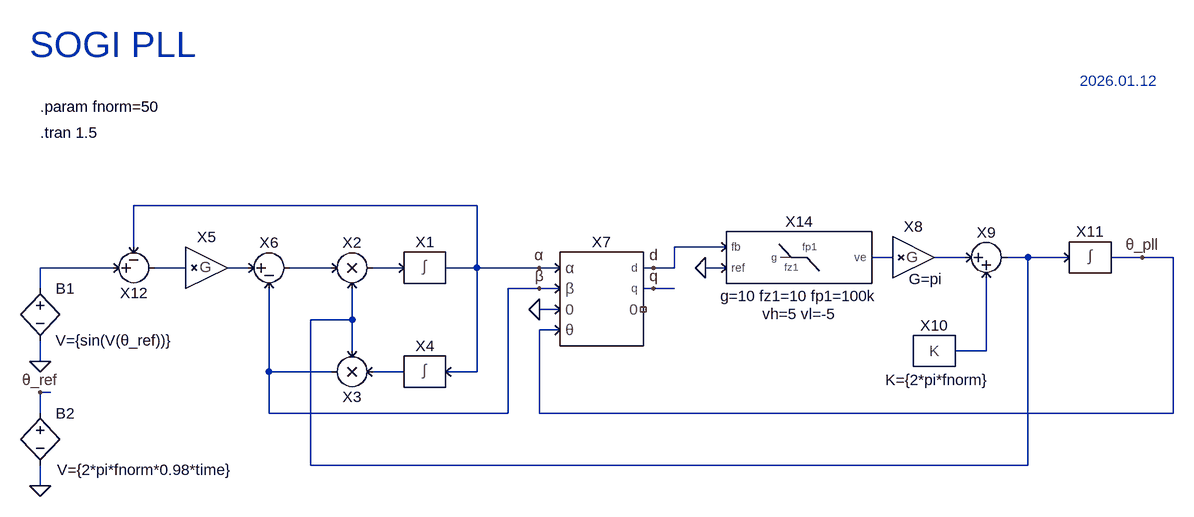
[diagram p0: schematic SOGI_PLL.asc]
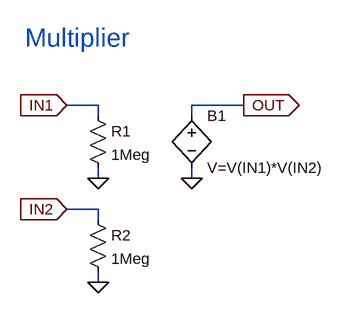
[diagram p1: sub-circuit mul.asc]
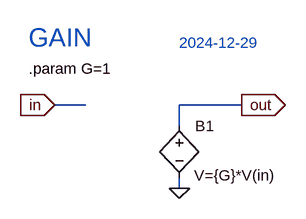
[diagram p2: sub-circuit gain.asc]
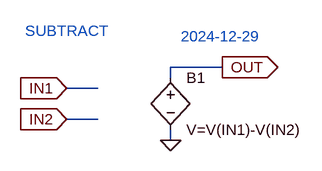
[diagram p3: sub-circuit sub.asc]
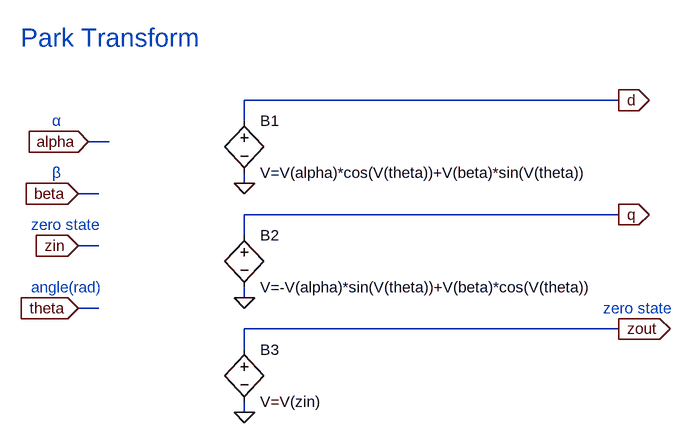
[diagram p4: sub-circuit park.asc]
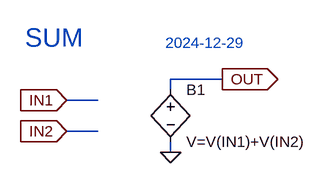
[diagram p5: sub-circuit sum.asc]
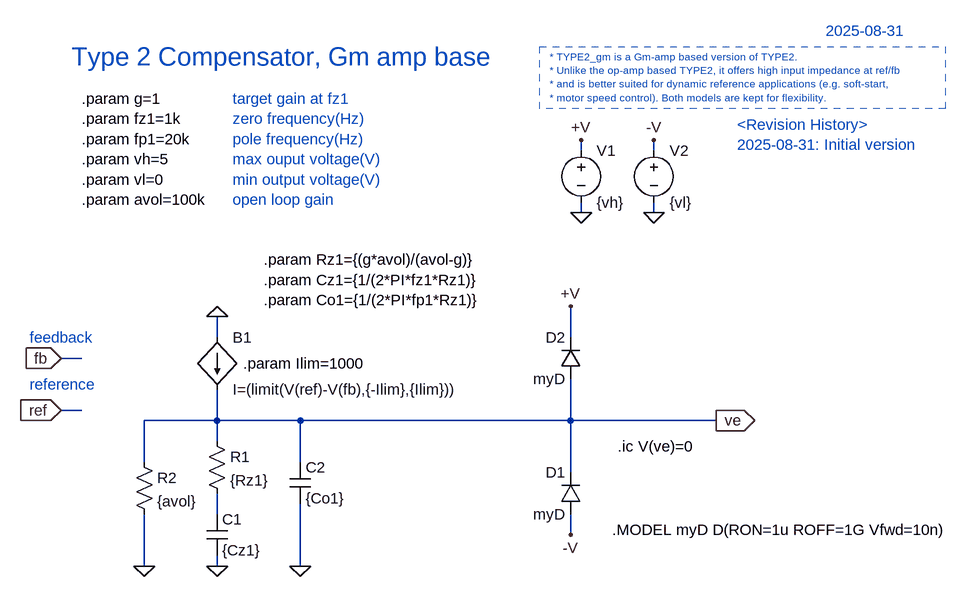
[diagram p6: sub-circuit type2_gm.asc]
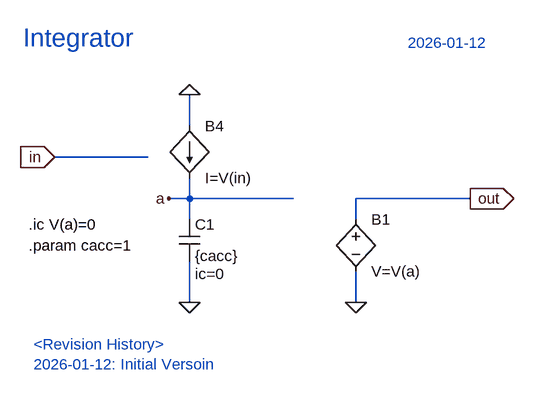
[diagram p7: sub-circuit integrator.asc]
SOGI_PLL.asc, the LTspice schematic file:
Version 4.1
SHEET 1 2644 924
WIRE 1264 0 736 0
WIRE 736 64 736 0
WIRE 1648 64 1568 64
WIRE 1904 80 1872 80
WIRE 2016 80 1968 80
WIRE 2112 80 2080 80
WIRE 2176 80 2112 80
WIRE 2288 80 2240 80
WIRE 2336 80 2288 80
WIRE 704 96 592 96
WIRE 816 96 768 96
WIRE 912 96 880 96
WIRE 1040 96 976 96
WIRE 1152 96 1104 96
WIRE 1264 96 1264 0
WIRE 1264 96 1216 96
WIRE 1360 96 1264 96
WIRE 1392 96 1360 96
WIRE 1536 96 1520 96
WIRE 1568 96 1568 64
WIRE 1568 96 1536 96
WIRE 1648 96 1616 96
WIRE 592 128 592 96
WIRE 1360 128 1312 128
WIRE 1392 128 1360 128
WIRE 1536 128 1520 128
WIRE 1568 128 1536 128
WIRE 1392 160 1360 160
WIRE 1072 176 1072 128
WIRE 1072 176 1008 176
WIRE 1392 192 1360 192
WIRE 1072 224 1072 176
WIRE 2048 224 2048 112
WIRE 2048 224 2000 224
WIRE 592 240 592 208
WIRE 944 256 944 128
WIRE 1040 256 944 256
WIRE 1152 256 1104 256
WIRE 1264 256 1264 96
WIRE 1264 256 1216 256
WIRE 608 288 592 288
WIRE 592 320 592 288
WIRE 944 320 944 256
WIRE 1312 320 1312 128
WIRE 1312 320 944 320
WIRE 1360 320 1360 192
WIRE 2336 320 2336 80
WIRE 2336 320 1360 320
WIRE 1008 400 1008 176
WIRE 2112 400 2112 80
WIRE 2112 400 1008 400
WIRE 592 432 592 400
FLAG 1360 160 0
FLAG 2288 80 θ_pll
FLAG 1536 128 q
FLAG 1360 96 α
FLAG 1360 128 β
FLAG 1536 96 d
FLAG 592 240 0
FLAG 592 432 0
FLAG 592 288 θ_ref
FLAG 1616 96 0
SYMBOL PowerSim\\MUL 1072 96 R0
SYMATTR InstName X2
SYMBOL PowerSim\\MUL 1072 256 R180
SYMATTR InstName X3
SYMBOL PowerSim\\GAIN 848 96 R0
SYMATTR InstName X5
SYMBOL PowerSim\\SUB 944 96 R0
SYMATTR InstName X6
SYMBOL PowerSim\\PARK 1456 144 R0
SYMATTR InstName X7
SYMBOL PowerSim\\SUM 2048 80 R0
SYMATTR InstName X9
SYMBOL PowerSim\\CONST 1968 224 R0
WINDOW 39 4 60 Bottom 2
SYMATTR SpiceLine K={2*pi*fnorm}
SYMATTR InstName X10
SYMBOL PowerSim\\SUB 736 96 M180
SYMATTR InstName X12
SYMBOL PowerSim\\TYPE2_gm 1760 80 R0
WINDOW 39 0 75 Bottom 2
WINDOW 40 0 103 Bottom 2
SYMATTR SpiceLine g=10 fz1=10 fp1=100k
SYMATTR SpiceLine2 vh=5 vl=-5
SYMATTR InstName X14
SYMBOL bv 592 112 R0
SYMATTR InstName B1
SYMATTR Value V={sin(V(θ_ref))}
SYMBOL bv 592 304 R0
WINDOW 3 26 103 Left 2
SYMATTR Value V={2*pi*fnorm*0.98*time}
SYMATTR InstName B2
SYMBOL PowerSim\\GAIN 1936 80 R0
WINDOW 39 19 49 Bottom 2
SYMATTR SpiceLine G=pi
SYMATTR InstName X8
SYMBOL PowerSim\\INTEGRATOR 1184 96 R0
SYMATTR InstName X1
SYMBOL PowerSim\\INTEGRATOR 1184 256 M0
SYMATTR InstName X4
SYMBOL PowerSim\\INTEGRATOR 2208 80 R0
SYMATTR InstName X11
TEXT 592 -152 Left 2 !.param fnorm=50
TEXT 592 -112 Left 2 !.tran 1.5
TEXT 576 -248 Left 5 ;SOGI PLL
TEXT 2192 -192 Left 2 ;2026.01.12

mul.asc, the sub-circuit schematic file:
Version 4
SHEET 1 880 680
WIRE 96 48 48 48
WIRE 320 48 240 48
WIRE 96 64 96 48
WIRE 240 64 240 48
WIRE 96 160 96 144
WIRE 240 160 240 144
WIRE 96 208 48 208
WIRE 96 224 96 208
WIRE 96 320 96 304
FLAG 48 48 IN1
IOPIN 48 48 In
FLAG 48 208 IN2
IOPIN 48 208 In
FLAG 240 160 0
FLAG 320 48 OUT
IOPIN 320 48 Out
FLAG 96 160 0
FLAG 96 320 0
SYMBOL bv 240 48 R0
SYMATTR InstName B1
SYMATTR Value V=V(IN1)*V(IN2)
SYMBOL res 80 48 R0
SYMATTR InstName R1
SYMATTR Value 1Meg
SYMBOL res 80 208 R0
SYMATTR InstName R2
SYMATTR Value 1Meg
TEXT -16 -56 Left 4 ;Multiplier

gain.asc, the sub-circuit schematic file:
Version 4
SHEET 1 880 680
WIRE 0 64 -48 64
WIRE 240 64 144 64
WIRE 144 96 144 64
WIRE 144 192 144 176
FLAG 144 192 0
FLAG 240 64 out
IOPIN 240 64 Out
FLAG -48 64 in
IOPIN -48 64 In
SYMBOL bv 144 80 R0
WINDOW 3 23 92 Left 2
SYMATTR Value V={G}*V(in)
SYMATTR InstName B1
TEXT -88 8 Left 2 !.param G=1
TEXT -88 -40 Left 4 ;GAIN
TEXT 144 -32 Left 2 ;2024-12-29

sub.asc, the sub-circuit schematic file:
Version 4
SHEET 1 880 680
WIRE 288 96 208 96
WIRE 208 112 208 96
WIRE 96 128 48 128
WIRE 96 176 48 176
WIRE 208 208 208 192
FLAG 48 128 IN1
IOPIN 48 128 In
FLAG 48 176 IN2
IOPIN 48 176 In
FLAG 208 208 0
FLAG 288 96 OUT
IOPIN 288 96 Out
SYMBOL bv 208 96 R0
SYMATTR InstName B1
SYMATTR Value V=V(IN1)-V(IN2)
TEXT -16 40 Left 2 ;SUBTRACT
TEXT 224 48 Left 2 ;2024-12-29

park.asc, the sub-circuit schematic file:
Version 4
SHEET 1 880 680
WIRE 592 96 16 96
WIRE 16 128 16 96
WIRE -192 160 -224 160
WIRE 16 224 16 208
WIRE -208 240 -240 240
WIRE 592 272 16 272
WIRE 16 304 16 272
WIRE -208 320 -240 320
WIRE 16 400 16 384
WIRE -208 416 -240 416
WIRE 592 448 16 448
WIRE 16 480 16 448
WIRE 16 576 16 560
FLAG 16 224 0
FLAG 592 96 d
IOPIN 592 96 Out
FLAG -224 160 alpha
IOPIN -224 160 In
FLAG -240 320 zin
IOPIN -240 320 In
FLAG 16 400 0
FLAG 592 272 q
IOPIN 592 272 Out
FLAG 16 576 0
FLAG 592 448 zout
IOPIN 592 448 Out
FLAG -240 416 theta
IOPIN -240 416 In
FLAG -240 240 beta
IOPIN -240 240 In
SYMBOL bv 16 112 R0
SYMATTR InstName B1
SYMATTR Value V=V(alpha)*cos(V(theta))+V(beta)*sin(V(theta))
SYMBOL bv 16 288 R0
SYMATTR InstName B2
SYMATTR Value V=-V(alpha)*sin(V(theta))+V(beta)*cos(V(theta))
SYMBOL bv 16 464 R0
SYMATTR InstName B3
SYMATTR Value V=V(zin)
TEXT -328 0 Left 4 ;Park Transform
TEXT -280 128 Left 2 ;α
TEXT -280 208 Left 2 ;β
TEXT -312 288 Left 2 ;zero state
TEXT -312 384 Left 2 ;angle(rad)
TEXT 568 416 Left 2 ;zero state

sum.asc, the sub-circuit schematic file:
Version 4
SHEET 1 880 680
WIRE 288 96 208 96
WIRE 208 112 208 96
WIRE 96 128 48 128
WIRE 96 176 48 176
WIRE 208 208 208 192
FLAG 48 128 IN1
IOPIN 48 128 In
FLAG 48 176 IN2
IOPIN 48 176 In
FLAG 208 208 0
FLAG 288 96 OUT
IOPIN 288 96 Out
SYMBOL bv 208 96 R0
SYMATTR InstName B1
SYMATTR Value V=V(IN1)+V(IN2)
TEXT -16 32 Left 4 ;SUM
TEXT 200 40 Left 2 ;2024-12-29

type2_gm.asc, the sub-circuit schematic file:
Version 4.1
SHEET 1 1136 680
WIRE 432 -144 432 -160
WIRE 544 -144 544 -160
WIRE 432 -48 432 -64
WIRE 544 -48 544 -64
WIRE -128 144 -128 112
WIRE 416 144 416 96
WIRE -336 176 -368 176
WIRE -336 256 -368 256
WIRE -128 272 -128 224
WIRE -128 272 -240 272
WIRE 0 272 -128 272
WIRE 416 272 416 208
WIRE 416 272 0 272
WIRE 640 272 416 272
WIRE -128 304 -128 272
WIRE -240 336 -240 272
WIRE 0 336 0 272
WIRE 416 352 416 272
WIRE -128 416 -128 384
WIRE 416 448 416 416
WIRE -240 496 -240 416
WIRE -128 496 -128 480
WIRE 0 496 0 400
FLAG 640 272 ve
IOPIN 640 272 Out
FLAG -128 496 0
FLAG -240 496 0
FLAG 0 496 0
FLAG -128 112 0
FLAG 544 -48 0
FLAG 432 -48 0
FLAG 432 -160 +V
FLAG 544 -160 -V
FLAG 416 448 -V
FLAG 416 96 +V
FLAG -368 176 fb
IOPIN -368 176 In
FLAG -368 256 ref
IOPIN -368 256 In
SYMBOL bi -128 144 R0
SYMATTR InstName B1
SYMATTR Value I=(limit(V(ref)-V(fb),{-Ilim},{Ilim}))
SYMBOL res -144 288 R0
SYMATTR InstName R1
SYMATTR Value {Rz1}
SYMBOL cap -144 416 R0
SYMATTR InstName C1
SYMATTR Value {Cz1}
SYMBOL res -256 320 R0
SYMATTR InstName R2
SYMATTR Value {avol}
SYMBOL cap -16 336 R0
SYMATTR InstName C2
SYMATTR Value {Co1}
SYMBOL diode 432 416 R180
WINDOW 0 24 64 Left 2
WINDOW 3 24 0 Left 2
SYMATTR InstName D1
SYMATTR Value myD
SYMBOL voltage 432 -160 R0
SYMATTR InstName V1
SYMATTR Value {vh}
SYMBOL voltage 544 -160 R0
WINDOW 123 0 0 Left 0
WINDOW 39 24 44 Left 2
SYMATTR InstName V2
SYMATTR Value {vl}
SYMBOL diode 432 208 R180
WINDOW 0 24 64 Left 2
WINDOW 3 24 0 Left 2
SYMATTR InstName D2
SYMATTR Value myD
TEXT -336 -224 Left 2 !.param g=1\n.param fz1=1k\n.param fp1=20k\n.param vh=5\n.param vl=0\n.param avol=100k
TEXT -352 -288 Left 4 ;Type 2 Compensator, Gm amp base
TEXT -104 -224 Left 2 ;target gain at fz1\nzero frequency(Hz)\npole frequency(Hz)\nmax ouput voltage(V)\nmin output voltage(V)\nopen loop gain
TEXT 808 -328 Left 2 ;2025-08-31
TEXT -56 24 Left 2 !.param Rz1={(g*avol)/(avol-g)}\n.param Cz1={1/(2*PI*fz1*Rz1)}\n.param Co1={1/(2*PI*fp1*Rz1)}
TEXT 488 312 Left 2 !.ic V(ve)=0
TEXT 480 440 Left 2 !.MODEL myD D(RON=1u ROFF=1G Vfwd=10n)
TEXT -88 184 Left 2 !.param Ilim=1000
TEXT 672 -184 Left 2 ;<Revision History>\n2025-08-31: Initial version
TEXT -416 144 Left 2 ;feedback
TEXT -416 216 Left 2 ;reference
TEXT 384 -288 Left 1 ;* TYPE2_gm is a Gm-amp based version of TYPE2.\n* Unlike the op-amp based TYPE2, it offers high input impedance at ref/fb\n* and is better suited for dynamic reference applications (e.g. soft-start,\n* motor speed control). Both models are kept for flexibility.
RECTANGLE Normal 992 -208 368 -304 2

integrator.asc, the sub-circuit schematic file:
Version 4.1
SHEET 1 2304 924
WIRE 704 -64 704 -112
WIRE 640 -16 496 -16
WIRE 704 48 704 16
WIRE 704 48 672 48
WIRE 864 48 704 48
WIRE 1136 48 960 48
WIRE 704 80 704 48
WIRE 960 80 960 48
WIRE 704 208 704 144
WIRE 960 208 960 160
FLAG 496 -16 in
IOPIN 496 -16 In
FLAG 704 -112 0
FLAG 704 208 0
FLAG 1136 48 out
IOPIN 1136 48 Out
FLAG 672 48 a
FLAG 960 208 0
SYMBOL cap 688 80 R0
WINDOW 123 24 84 Left 2
SYMATTR Value2 ic=0
SYMATTR InstName C1
SYMATTR Value {cacc}
SYMBOL bv 960 64 R0
SYMATTR InstName B1
SYMATTR Value V=V(a)
SYMBOL bi 704 -64 R0
SYMATTR InstName B4
SYMATTR Value I=V(in)
TEXT 448 -200 Left 4 ;Integrator
TEXT 1040 -192 Left 2 ;2026-01-12
TEXT 464 272 Left 2 ;<Revision History>\n2026-01-12: Initial Versoin
TEXT 456 120 Left 2 !.param cacc=1
TEXT 456 88 Left 2 !.ic V(a)=0

The netlist it stands for:
* SOGI_PLL.asc
X§X2 N007 N003 N008 mul
X§X3 N010 N003 β mul
X§X5 N005 N006 gain params: G=1
X§X6 N006 β N007 sub
X§X7 α β θ_pll 0 d q NC_01 park
X§X9 N002 N009 N003 sum
X§X10 N009 CONST K={2*pi*fnorm}  ; pins K
X§X12 N004 α N005 sub
X§X14 d 0 N001 type2_gm params: avol=100k g=10 fz1=10 fp1=100k vh=5 vl=-5
B1 N004 0 V={sin(V(θ_ref))}
B2 θ_ref 0 V={2*pi*fnorm*0.98*time}
X§X8 N001 N002 gain params: G=pi
X§X1 N008 α integrator
X§X4 α N010 integrator
X§X11 N003 θ_pll integrator

* block symbol definitions
.subckt mul in1 in2 out
B1 OUT 0 V=V(IN1)*V(IN2)
R1 IN1 0 1Meg
R2 IN2 0 1Meg
* Multiplier
.ends mul

.subckt gain in out
B1 out 0 V={G}*V(in)
.param G=1
* GAIN
* 2024-12-29
.ends gain

.subckt sub in1 in2 out
B1 OUT 0 V=V(IN1)-V(IN2)
* SUBTRACT
* 2024-12-29
.ends sub

.subckt park alpha beta theta zin d q zout
B1 d 0 V=V(alpha)*cos(V(theta))+V(beta)*sin(V(theta))
B2 q 0 V=-V(alpha)*sin(V(theta))+V(beta)*cos(V(theta))
B3 zout 0 V=V(zin)
* Park Transform
* α
* β
* zero state
* angle(rad)
* zero state
.ends park

.subckt sum in1 in2 out
B1 OUT 0 V=V(IN1)+V(IN2)
* SUM
* 2024-12-29
.ends sum

.subckt type2_gm fb ref ve
B1 0 ve I=(limit(V(ref)-V(fb),{-Ilim},{Ilim}))
R1 ve N001 {Rz1}
C1 N001 0 {Cz1}
R2 ve 0 {avol}
C2 ve 0 {Co1}
D1 -V ve myD
V1 +V 0 {vh}
V2 -V 0 {vl}
D2 ve +V myD
.param g=1
.param fz1=1k
.param fp1=20k
.param vh=5
.param vl=0
.param avol=100k
* Type 2 Compensator, Gm amp base
* target gain at fz1
* zero frequency(Hz)
* pole frequency(Hz)
* max ouput voltage(V)
* min output voltage(V)
* open loop gain
* 2025-08-31
.param Rz1={(g*avol)/(avol-g)}
.param Cz1={1/(2*PI*fz1*Rz1)}
.param Co1={1/(2*PI*fp1*Rz1)}
.ic V(ve)=0
.MODEL myD D(RON=1u ROFF=1G Vfwd=10n)
.param Ilim=1000
* <Revision History>
* 2025-08-31: Initial version
* feedback
* reference
* * TYPE2_gm is a Gm-amp based version of TYPE2.
* * Unlike the op-amp based TYPE2, it offers high input impedance at ref/fb
* * and is better suited for dynamic reference applications (e.g. soft-start,
* * motor speed control). Both models are kept for flexibility.
.ends type2_gm

.subckt integrator in out
C1 a 0 {cacc} ic=0
B1 out 0 V=V(a)
B4 0 a I=V(in)
* Integrator
* 2026-01-12
* <Revision History>
* 2026-01-12: Initial Versoin
.param cacc=1
.ic V(a)=0
.ends integrator

.model D D
.lib standard.dio
.param fnorm=50
.tran 1.5
* SOGI PLL
* 2026.01.12
.backanno
.end